# Altium schematic sheet s02_power.SchDoc
size A4
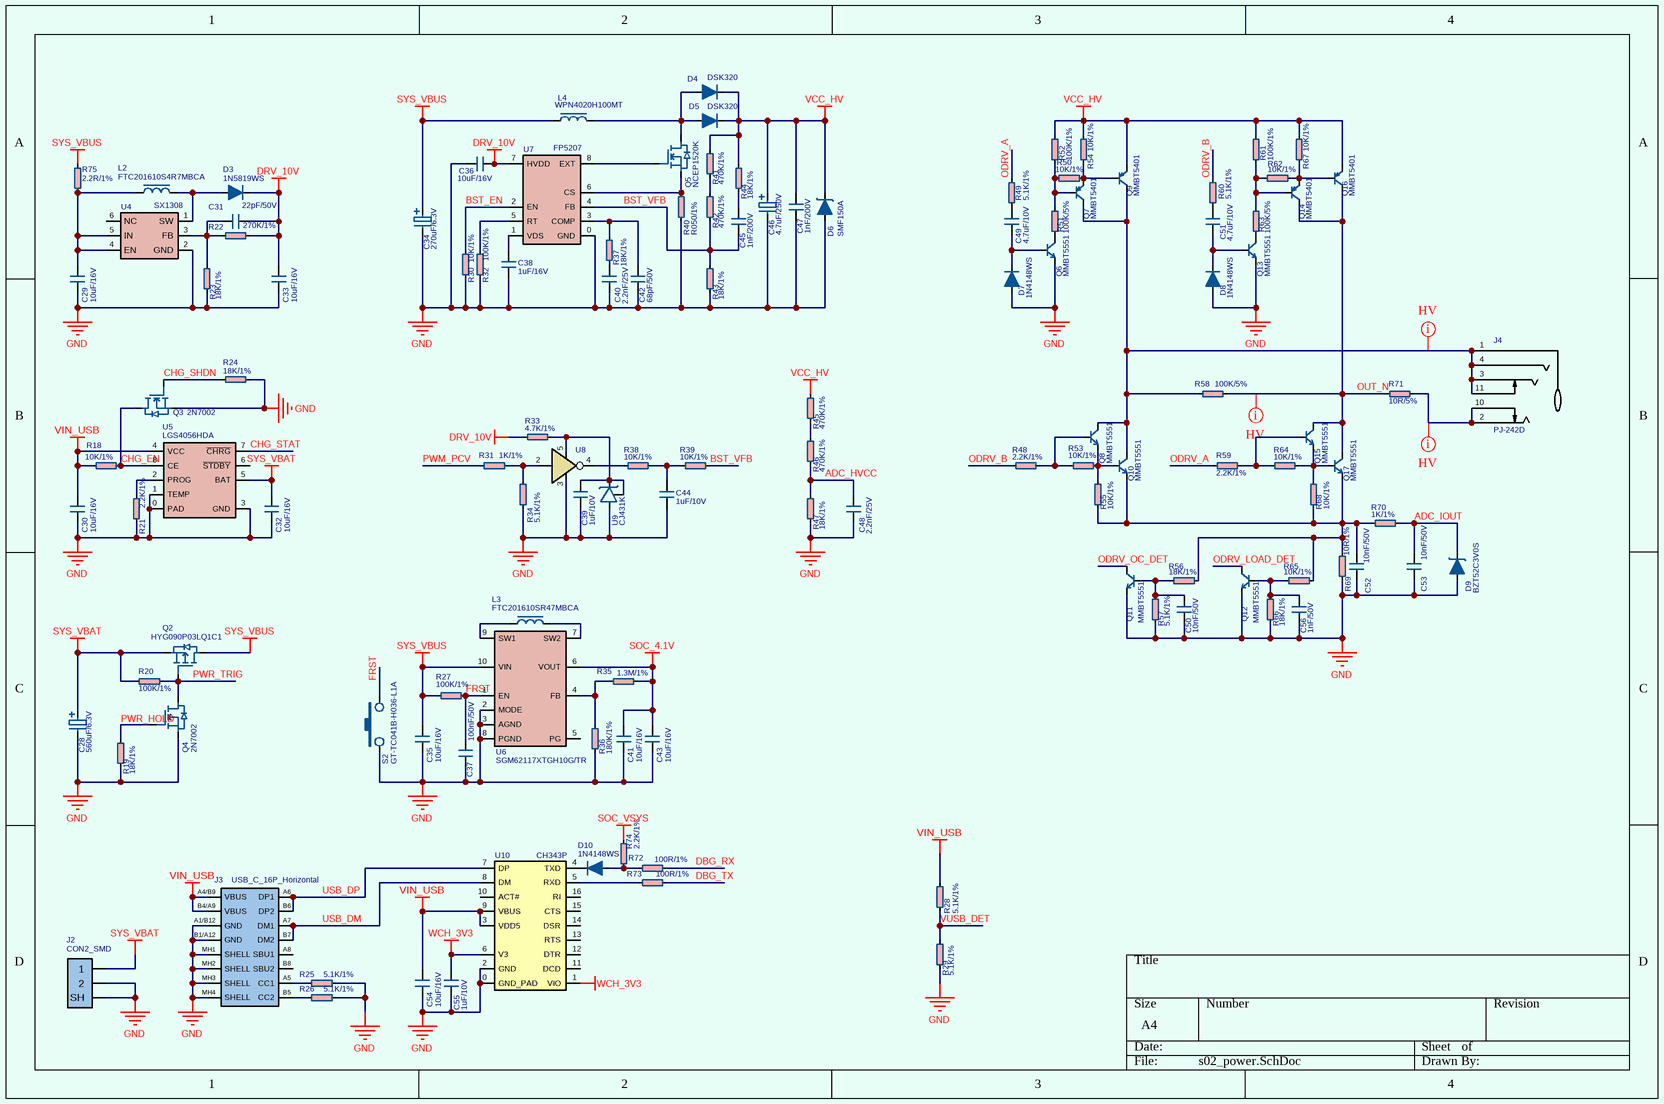
[diagram p0: s02_power.SchDoc]

## Parts
C28  560uF/6.3V  [CAP_EL_DIP_6.3X11_HOR_REV]
C29  10uF/16V  [0603C]
C30  10uF/16V  [0603C]
C31  22pF/50V  [0402C]
C32  10uF/16V  [0603C]
C33  10uF/16V  [0603C]
C34  270uF/6.3V  [CAP_EL_DIP_6.3X11_HOR_REV]
C35  10uF/16V  [0603C]
C36  10uF/16V  [0603C]
C37  100nF/50V  [0402C]
C38  1uF/16V  [0402C]
C39  1uF/10V  [0402C]
C40  2.2nF/25V  [0402C]
C41  10uF/16V  [0603C]
C42  68pF/50V  [0402C]
C43  10uF/16V  [0603C]
C44  1uF/10V  [0402C]
C45  1nF/200V  [0805C_N_HD]
C46  4.7uF/250V  [CAP_EL_DIP_6.3X11_HOR_REV]
C47  1nF/200V  [0805C_N_HD]
C48  2.2nF/25V  [0402C]
C49  4.7uF/10V  [0402C]
C50  10nF/50V  [0402C]
C51  4.7uF/10V  [0402C]
C52  10nF/50V  [0402C]
C53  10nF/50V  [0402C]
C54  10uF/16V  [0603C]
C55  1uF/10V  [0402C]
C56  1nF/50V  [0402C]
D3  1N5819WS  [SOD323_N]
D4  DSK320  [SOD123_N_HD]
D5  DSK320  [SOD123_N_HD]
D6  SMF150A  [SOD123_N_HD]
D7  1N4148WS  [SOD323]
D8  1N4148WS  [SOD323]
D9  BZT52C3V0S  [SOD323_N]
D10  1N4148WS  [SOD323]
J2  CON2_SMD  [PRT_1.25MM_2PIN_HOR_SMD]
J3  USB_C_16P_Horizontal  [USB_C_16P_FEMALE_HOR_L7.3_HD]
J4  PJ-242D  [CON_AUDIO_PJ_242]
L2  FTC201610S4R7MBCA  [INDUCTOR_0806_HD]
L3  FTC201610SR47MBCA  [INDUCTOR_0806_HD]
L4  WPN4020H100MT  [INDUCTOR_SWPA4020S]
Q2  HYG090P03LQ1C1  [DFN8_MOS_3X3]
Q3  2N7002  [SOT23_MOS]
Q4  2N7002  [SOT23_MOS]
Q5  NCEP1520K  [TO252_MOS]
Q6  MMBT5551  [SOT23_BCE]
Q7  MMBT5401  [SOT23_BCE]
Q8  MMBT5551  [SOT23_BCE]
Q9  MMBT5401  [SOT23_BCE]
Q10  MMBT5551  [SOT23_BCE]
Q11  MMBT5551  [SOT23_BCE]
Q12  MMBT5551  [SOT23_BCE]
Q13  MMBT5551  [SOT23_BCE]
Q14  MMBT5401  [SOT23_BCE]
Q15  MMBT5551  [SOT23_BCE]
Q16  MMBT5401  [SOT23_BCE]
Q17  MMBT5551  [SOT23_BCE]
R18  10K/1%  [0402R]
R19  18K/1%  [0402R]
R20  100K/1%  [0402R]
R21  2.2K/1%  [0402R]
R22  270K/1%  [0402R]
R23  18K/1%  [0402R]
R24  18K/1%  [0402R]
R25  5.1K/1%  [0402R]
R26  5.1K/1%  [0402R]
R27  100K/1%  [0402R]
R28  5.1K/1%  [0402R]
R29  5.1K/1%  [0402R]
R30  10K/1%  [0402R]
R31  1K/1%  [0402R]
R32  100K/1%  [0402R]
R33  4.7K/1%  [0402R]
R34  5.1K/1%  [0402R]
R35  1.3M/1%  [0402R]
R36  180K/1%  [0402R]
R37  18K/1%  [0402R]
R38  10K/1%  [0402R]
R39  10K/1%  [0402R]
R40  R050/1%  [1206R_N_HD]
R41  470K/1%  [0805R_N_HD]
R42  470K/1%  [0805R_N_HD]
R43  18K/1%  [0402R]
R44  18K/1%  [0402R]
R45  470K/1%  [0805R_N_HD]
R46  470K/1%  [0805R_N_HD]
R47  18K/1%  [0402R]
R48  2.2K/1%  [0402R]
R49  5.1K/1%  [0402R]
R50  10K/1%  [0402R]
R51  100K/5%  [0805R]
R52  100K/1%  [0402R]
R53  10K/1%  [0402R]
R54  10K/1%  [0402R]
R55  10K/1%  [0402R]
R56  18K/1%  [0402R]
R57  5.1K/1%  [0402R]
R58  100K/5%  [0805R]
R59  2.2K/1%  [0402R]
R60  5.1K/1%  [0402R]
R61  100K/1%  [0402R]
R62  10K/1%  [0402R]
R63  100K/5%  [0805R]
R64  10K/1%  [0402R]
R65  10K/1%  [0402R]
R66  18K/1%  [0402R]
R67  10K/1%  [0402R]
R68  10K/1%  [0402R]
R69  10R/1%  [0805R_N_HD]
R70  1K/1%  [0402R]
R71  10R/5%  [0805R]
R72  100R/1%  [0402R]
R73  100R/1%  [0402R]
R74  2.2K/1%  [0402R]
R75  2.2R/1%  [0402R]
S2  GT-TC041B-H036-L1A  [SW_MEDIUM_TURTLE]
U4  SX1308  [SOT23_6]
U5  LGS4056HDA  [DFN8_0.5_2X2]
U6  SGM62117XTGH10G/TR  [DFN8_0.5_3X2_SGM62117]
U7  FP5207  [SOP8_150MIL_PAD_N_HD]
U8  SN74LVC1G14DBVR  [SOT23_5]  (value not drawn)
U9  CJ431K  [SOT23]
U10  CH343P  [QFN16_0.5_3X3]

## Nets
DRV_10V: C31.1 C33.1 C36.1 D3.2 R22.1 R33.1 U7.7(HVDD)
GND: C28.2 C29.2 C30.2 C32.2 C33.2 C34.2 C35.2 C36.2 C37.1 C38.1 C39.1 C40.1 C41.2 C42.1 C43.2 C44.1 C46.2 C47.1 C48.1 C50.1 C52.1 C53.1 C54.2 C55.1 C56.1 D6.1 D7.1 D8.1 D9.1 J2.0(SH) J2.2 J3.A1/B12(GND) J3.B1/A12(GND) J3.MH1(SHELL) J3.MH2(SHELL) J3.MH3(SHELL) J3.MH4(SHELL) Q3.S Q4.S Q6.E Q11.E Q12.E Q13.E R19.1 R21.2 R23.1 R24.1 R25.1 R26.1 R29.1 R30.1 R32.1 R34.2 R36.2 R40.1 R43.1 R47.1 R57.2 R66.2 R69.2 S2.2 U4.2(GND) U5.0(PAD) U5.1(TEMP) U5.3(GND) U6.2(MODE) U6.3(AGND) U6.8(PGND) U7.0(GND) U8.3(G) U9.3 U10.0(GND_PAD) U10.2(GND)
SOC_4.1V: C41.1 C43.1 R35.2 U6.6(VOUT)
SOC_VSYS: R74.1
SYS_VBAT: C28.1 C32.1 J2.1 Q2.S R20.2 U5.5(BAT)
SYS_VBUS: C34.1 C35.1 L4.1 Q2.D R27.2 R75.1 U6.10(VIN)
VCC_HV: C46.1 C47.2 D4.2 D5.2 D6.2 Q9.E Q16.E R41.2 R44.2 R45.2 R52.1 R54.1 R61.1 R67.1
VIN_USB: C30.1 C54.1 J3.A4/B9(VBUS) J3.B4/A9(VBUS) R18.2 R28.2 U5.4(VCC) U10.3(VDD5) U10.9(VBUS)
WCH_3V3: C55.2 U10.1(VIO) U10.6(V3)
ADC_HVCC: C48.2 R46.1 R47.2
ADC_IOUT: C53.2 D9.2 R70.1
BST_EN: R30.2 U7.2(EN)
BST_VFB: C45.1 R39.1 R42.1 R43.2 U7.4(FB)
CHG_EN: Q3.D R18.1 U5.8(CE)
CHG_SHDN: Q3.G R24.2
CHG_STAT: U5.7(~{CHRG})
DBG_RX: R72.1
DBG_TX: R73.1
FRST: C37.2 R27.1 S2.1 U6.1(EN)
ODRV_A: R49.2 R59.2
ODRV_B: R48.2 R60.2
ODRV_LOAD_DET: Q12.C
ODRV_OC_DET: Q11.C
OUT_N: Q14.C Q15.C Q16.C Q17.C R58.2 R71.2
PWM_PCV: R31.2
PWR_HOLD: Q4.G R19.2
PWR_TRIG: Q2.G Q4.D R20.1
USB_DM: J3.A7(DM1) J3.B7(DM2) U10.8(DM)
USB_DP: J3.A6(DP1) J3.B6(DP2) U10.7(DP)
VUSB_DET: R28.1 R29.2
NetC29_1: C29.1 L2.1 R75.2 U4.4(EN) U4.5(IN)
NetC31_2: C31.2 R22.2 R23.2 U4.3(FB)
NetC38_2: C38.2 U7.1(VDS)
NetC39_2: C39.2 R33.2 U8.5(VCC) U9.1 U9.2
NetC40_2: C40.2 R37.1
NetC42_2: C42.2 R37.2 U7.3(COMP)
NetC44_2: C44.2 R38.1 R39.2
NetC45_2: C45.2 R44.1
NetC49_1: C49.1 R49.1
NetC49_2: C49.2 D7.2 Q6.B
NetC50_2: C50.2 Q11.B R56.2 R57.1
NetC51_1: C51.1 D8.2 Q13.B
NetC51_2: C51.2 R60.1
NetC52_2: C52.2 Q10.E Q17.E R55.1 R56.1 R65.1 R68.1 R69.1 R70.2
NetC56_2: C56.2 Q12.B R65.2 R66.1
NetD3_1: D3.1 L2.2 U4.1(SW)
NetD4_1: D4.1 D5.1 L4.2 Q5.D
NetD10_1: D10.1 R72.2 R74.2
NetD10_2: D10.2 U10.4(TXD)
NetJ3_A5: J3.A5(CC1) R25.2
NetJ3_B5: J3.B5(CC2) R26.2
NetJ4_1: J4.1 J4.3 J4.4 J4.11 Q7.C Q8.C Q9.C Q10.C R58.1
NetJ4_2: J4.2 J4.10 R71.1
NetL3_1: L3.1 U6.9(SW1)
NetL3_2: L3.2 U6.7(SW2)
NetQ5_G: Q5.G U7.8(EXT)
NetQ5_S: Q5.S R40.2 U7.6(CS)
NetQ6_C: Q6.C R51.2
NetQ7_B: Q7.B R50.2 R51.1 R52.2
NetQ7_E: Q7.E Q9.B R50.1 R54.2
NetQ8_B: Q8.B R48.1 R53.1
NetQ8_E: Q8.E Q10.B R53.2 R55.2
NetQ13_C: Q13.C R63.2
NetQ14_B: Q14.B R61.2 R62.2 R63.1
NetQ14_E: Q14.E Q16.B R62.1 R67.2
NetQ15_B: Q15.B R59.1 R64.1
NetQ15_E: Q15.E Q17.B R64.2 R68.2
NetR21_1: R21.1 U5.2(PROG)
NetR31_1: R31.1 R34.1 U8.2(A)
NetR32_2: R32.2 U7.5(RT)
NetR35_1: R35.1 R36.1 U6.4(FB)
NetR38_2: R38.2 U8.4(Y)
NetR41_1: R41.1 R42.2
NetR45_1: R45.1 R46.2
NetR73_2: R73.2 U10.5(RXD)

Not connected (* = marked no-connect by the designer): J3 A8(SBU1) B8(SBU2); U4 6(NC); U5 6(~{STDBY}); U6 5(PG); U10 10(ACT#) 11(DCD) 12(DTR) 13(RTS) 14(DSR) 15(CTS) 16(RI)

## Layout directives
net class HV: NetJ4_1, NetJ4_2, OUT_N

## Library data of the parts
C28 C34 C46 = CAP_EL
C29-C33 C35-C44 C48-C56 = CAP
C45 C47 = CAP: CC0805JRNPOABN102
D3-D5 D7 D8 D10 = VD
D6 D9 = VS
J3 = USB_TYPEC_16P_Horizontal_4MP
J4 = CON_AUDIO_PJ_242D
L2-L4 = INDUCTOR
Q2 = MOS_P
Q3-Q5 = MOS_N
Q6 Q8 Q10-Q13 Q15 Q17 = BJT_NPN
Q7 Q9 Q14 Q16 = BJT_PNP
R18-R75 = RES
S2 = SW_PB
U5 = TP4056
U6 = SGM62117: Buck-Boost Converter, 18uA, 2.2 to 5.5V IN, 1.8 to 5.2V OUT
U8 = SN74AHC1G14: 1-Channel Schmitt-Trigger Inverter Gate
U9 = TL431
U10 = CH343P: USB to UART converter